# EAGLE schematic circuit (EAGLE 5.10)
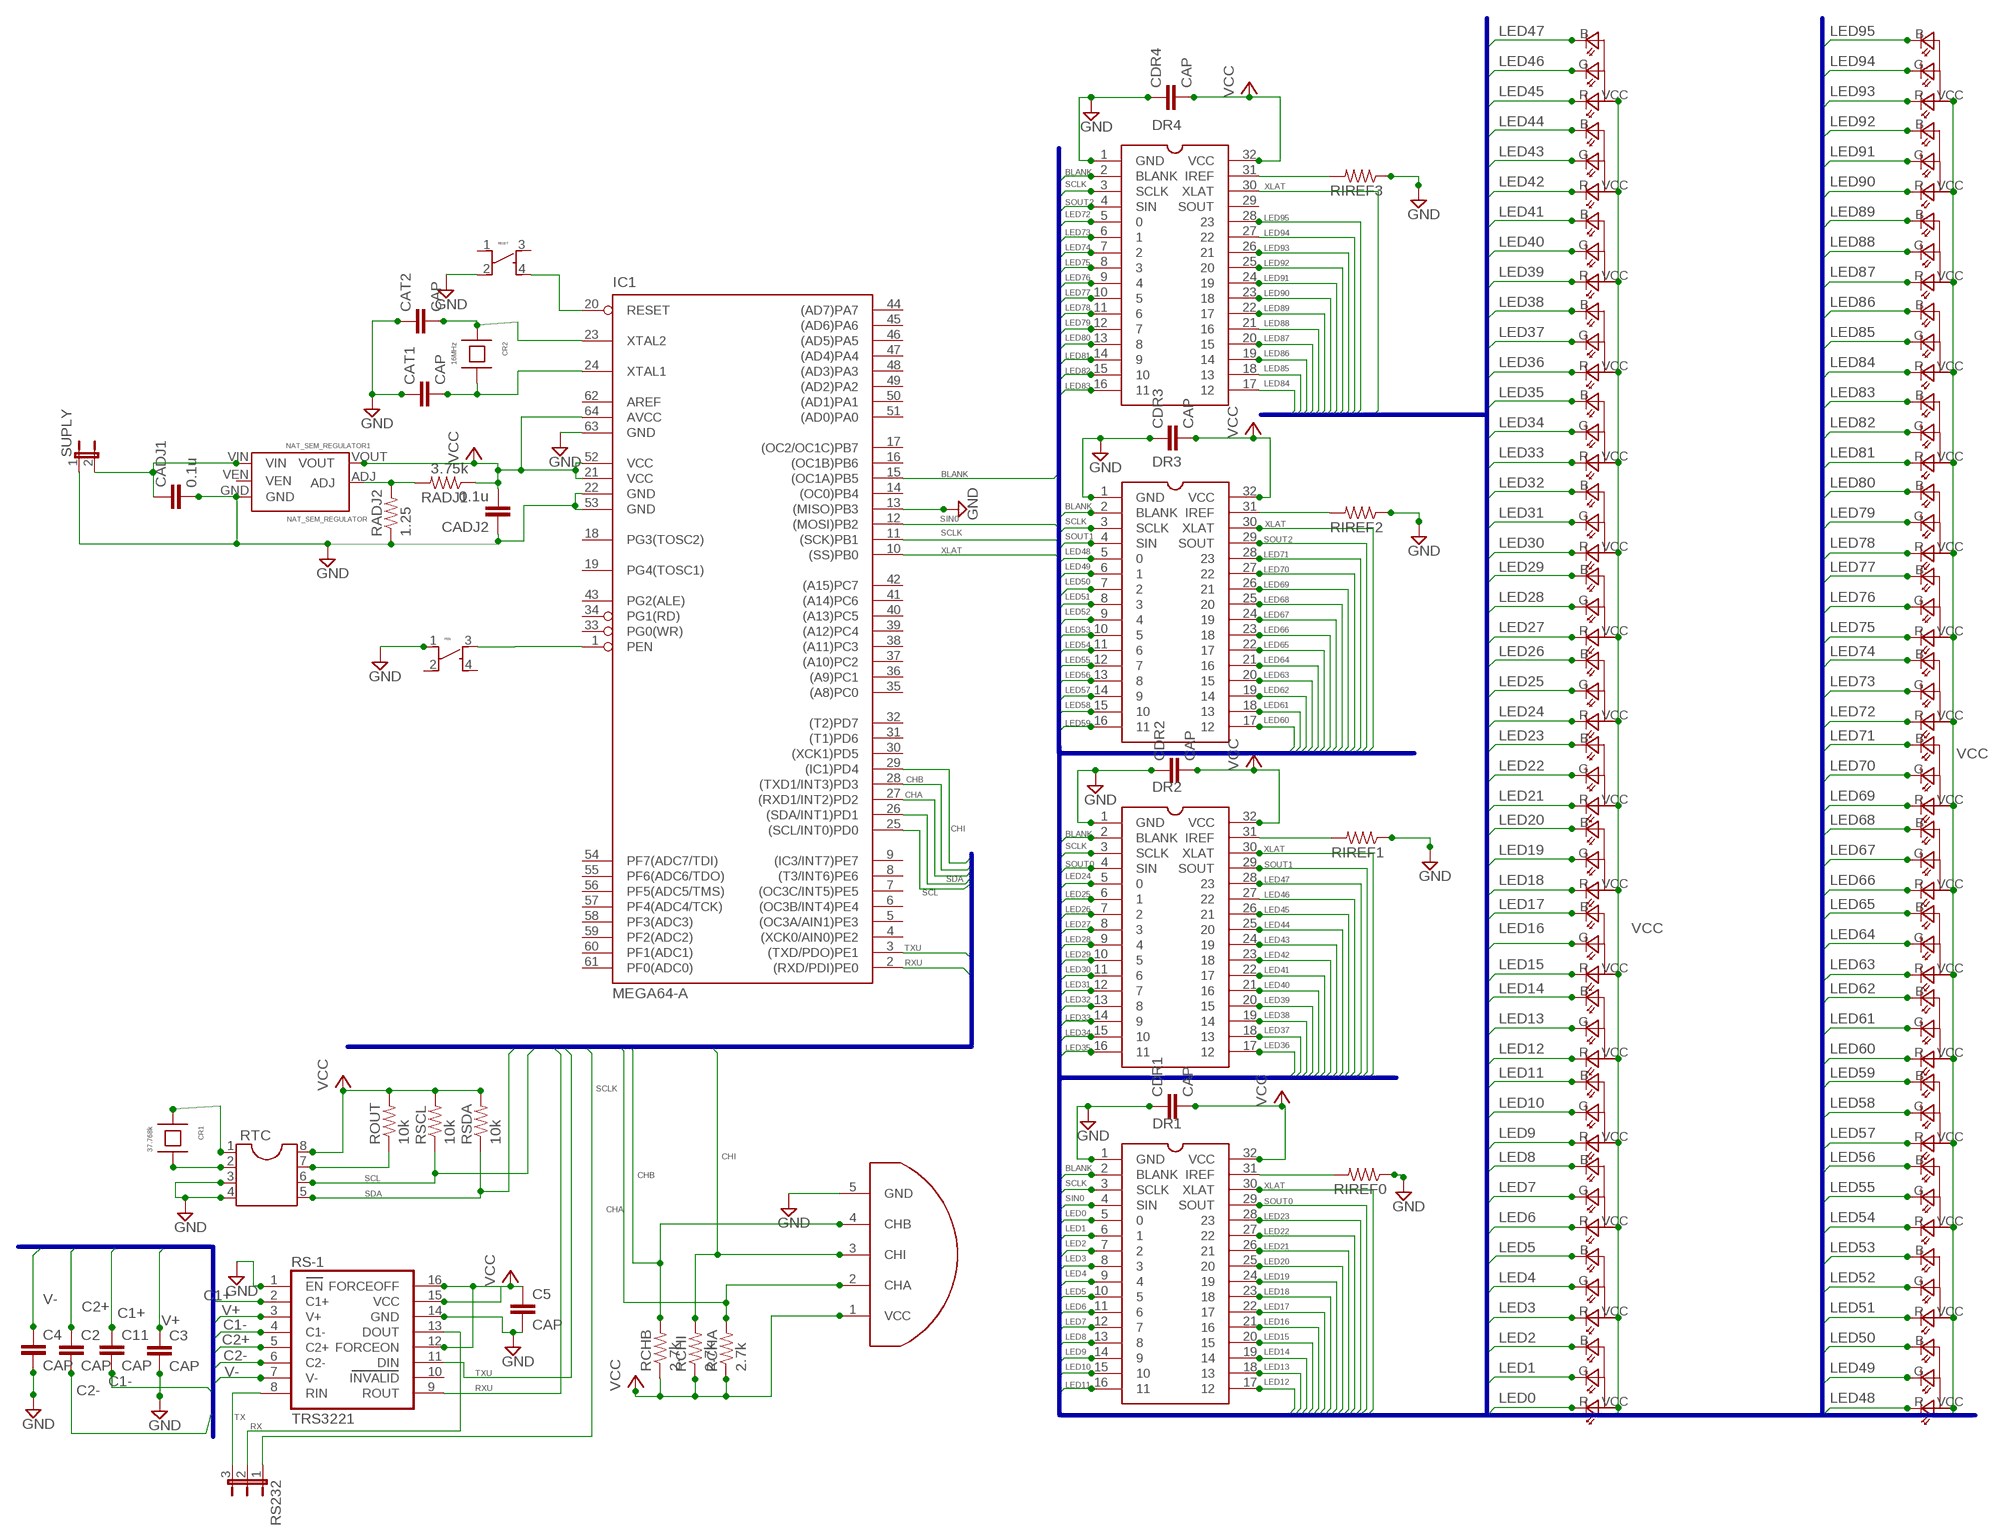
[diagram p0: schematic, sheet 1]

## Parts
C2  CAP  [CAP]
C3  CAP  [CAP]
C4  CAP  [CAP]
C5  CAP  [CAP]
C11  CAP  [CAP]
CADJ1  0.1u  CAP  [CAP]
CADJ2  0.1u  CAP  [CAP]
CAT1  CAP  [CAP]
CAT2  CAP  [CAP]
CDR1  CAP  [CAP]
CDR2  CAP  [CAP]
CDR3  CAP  [CAP]
CDR4  CAP  [CAP]
CR1  37.768k  CRYSTAL2  [CRYSTAL2]
CR2  16MHz  CRYSTAL2  [CRYSTAL2]
DR1  TLC5947  [TLC5947]
DR2  TLC5947  [TLC5947]
DR3  TLC5947  [TLC5947]
DR4  TLC5947  [TLC5947]
ENC  ENCODER-AEDB-9140  [ENCODER-AED8-9140]
IC1  MEGA64-A  [TQFP64]
NAT_SEM_REGULATOR1  NAT_SEM_REGULATOR  [NAT_SEM_REGULATOR]
PEN  PUSH_BUTTON  [PUSH_BUTTON]
RADJ1  3.75k  R-US_0204/5  [0204/5]
RADJ2  1.25  R-US_0204/5  [0204/5]
RCHA  2.7k  R-US_0204/5  [0204/5]
RCHB  2.7k  R-US_0204/5  [0204/5]
RCHI  2.7k  R-US_0204/5  [0204/5]
RESET  PUSH_BUTTON  [PUSH_BUTTON]
RGB1  ASMT-QTB0-0AA02-LED  [ASMT-QTB0-0AA02-LED]
RGB2  ASMT-QTB0-0AA02-LED  [ASMT-QTB0-0AA02-LED]
RGB3  ASMT-QTB0-0AA02-LED  [ASMT-QTB0-0AA02-LED]
RGB4  ASMT-QTB0-0AA02-LED  [ASMT-QTB0-0AA02-LED]
RGB5  ASMT-QTB0-0AA02-LED  [ASMT-QTB0-0AA02-LED]
RGB6  ASMT-QTB0-0AA02-LED  [ASMT-QTB0-0AA02-LED]
RGB7  ASMT-QTB0-0AA02-LED  [ASMT-QTB0-0AA02-LED]
RGB8  ASMT-QTB0-0AA02-LED  [ASMT-QTB0-0AA02-LED]
RGB9  ASMT-QTB0-0AA02-LED  [ASMT-QTB0-0AA02-LED]
RGB10  ASMT-QTB0-0AA02-LED  [ASMT-QTB0-0AA02-LED]
RGB11  ASMT-QTB0-0AA02-LED  [ASMT-QTB0-0AA02-LED]
RGB12  ASMT-QTB0-0AA02-LED  [ASMT-QTB0-0AA02-LED]
RGB13  ASMT-QTB0-0AA02-LED  [ASMT-QTB0-0AA02-LED]
RGB14  ASMT-QTB0-0AA02-LED  [ASMT-QTB0-0AA02-LED]
RGB15  ASMT-QTB0-0AA02-LED  [ASMT-QTB0-0AA02-LED]
RGB16  ASMT-QTB0-0AA02-LED  [ASMT-QTB0-0AA02-LED]
RGB17  ASMT-QTB0-0AA02-LED  [ASMT-QTB0-0AA02-LED]
RGB18  ASMT-QTB0-0AA02-LED  [ASMT-QTB0-0AA02-LED]
RGB19  ASMT-QTB0-0AA02-LED  [ASMT-QTB0-0AA02-LED]
RGB20  ASMT-QTB0-0AA02-LED  [ASMT-QTB0-0AA02-LED]
RGB21  ASMT-QTB0-0AA02-LED  [ASMT-QTB0-0AA02-LED]
RGB22  ASMT-QTB0-0AA02-LED  [ASMT-QTB0-0AA02-LED]
RGB23  ASMT-QTB0-0AA02-LED  [ASMT-QTB0-0AA02-LED]
RGB24  ASMT-QTB0-0AA02-LED  [ASMT-QTB0-0AA02-LED]
RGB25  ASMT-QTB0-0AA02-LED  [ASMT-QTB0-0AA02-LED]
RGB26  ASMT-QTB0-0AA02-LED  [ASMT-QTB0-0AA02-LED]
RGB27  ASMT-QTB0-0AA02-LED  [ASMT-QTB0-0AA02-LED]
RGB28  ASMT-QTB0-0AA02-LED  [ASMT-QTB0-0AA02-LED]
RGB29  ASMT-QTB0-0AA02-LED  [ASMT-QTB0-0AA02-LED]
RGB30  ASMT-QTB0-0AA02-LED  [ASMT-QTB0-0AA02-LED]
RGB31  ASMT-QTB0-0AA02-LED  [ASMT-QTB0-0AA02-LED]
RGB32  ASMT-QTB0-0AA02-LED  [ASMT-QTB0-0AA02-LED]
RIREF0  R-US_0204/5  [0204/5]
RIREF1  R-US_0204/5  [0204/5]
RIREF2  R-US_0204/5  [0204/5]
RIREF3  R-US_0204/5  [0204/5]
ROUT  10k  R-US_0204/5  [0204/5]
RS232  JP2W  [JP2W]
RS-1  TRS3221  [TRS3221]
RSCL  10k  R-US_0204/5  [0204/5]
RSDA  10k  R-US_0204/5  [0204/5]
RTC  DIL8  [DIL08]
SUPLY  JP1E  [JP1]

## Nets
BLANK: DR1.2(BLANK) DR2.2(BLANK) DR3.2(BLANK) DR4.2(BLANK) IC1.15((OC1A)PB5)
C1+: C11.1 RS-1.2(C1+)
C1-: C11.2 RS-1.4(C1-)
C2+: C2.1 RS-1.5(C2+)
C2-: C2.2 RS-1.6(C2-)
CHA: ENC.2(CHA) IC1.27((RXD1/INT2)PD2) RCHA.2
CHB: ENC.4(CHB) IC1.28((TXD1/INT3)PD3) RCHB.2
CHI: ENC.3(CHI) IC1.29((IC1)PD4) RCHI.2
GND: C3.2 C4.2 C5.2 CADJ1.2 CADJ2.1 CAT1.1 CAT2.1 CDR1.1 CDR2.1 CDR3.1 CDR4.1 DR1.1(GND) DR2.1(GND) DR3.1(GND) DR4.1(GND) ENC.5(GND) IC1.13((MISO)PB3) IC1.22(GND) IC1.53(GND) IC1.63(GND) NAT_SEM_REGULATOR1.GND PEN.1 RADJ2.1 RESET.2 RIREF0.1 RIREF1.1 RIREF2.1 RIREF3.1 RS-1.1(EN) RS-1.14(GND) RTC.3 RTC.4 SUPLY.1
IREF0: DR1.31(IREF) RIREF0.2
IREF1: DR2.31(IREF) RIREF1.2
IREF2: DR3.31(IREF) RIREF2.2
IREF3: DR4.31(IREF) RIREF3.2
LED0: DR1.5 RGB1.R
LED1: DR1.6 RGB1.G
LED2: DR1.7 RGB1.B
LED3: DR1.8 RGB2.R
LED4: DR1.9 RGB2.G
LED5: DR1.10 RGB2.B
LED6: DR1.11 RGB3.R
LED7: DR1.12 RGB3.G
LED8: DR1.13 RGB3.B
LED9: DR1.14 RGB4.R
LED10: DR1.15 RGB4.G
LED11: DR1.16 RGB4.B
LED12: DR1.17 RGB5.R
LED13: DR1.18 RGB5.G
LED14: DR1.19 RGB5.B
LED15: DR1.20 RGB6.R
LED16: DR1.21 RGB6.G
LED17: DR1.22 RGB6.B
LED18: DR1.23 RGB7.R
LED19: DR1.24 RGB7.G
LED20: DR1.25 RGB7.B
LED21: DR1.26 RGB8.R
LED22: DR1.27 RGB8.G
LED23: DR1.28 RGB8.B
LED24: DR2.5 RGB9.R
LED25: DR2.6 RGB9.G
LED26: DR2.7 RGB9.B
LED27: DR2.8 RGB10.R
LED28: DR2.9 RGB10.G
LED29: DR2.10 RGB10.B
LED30: DR2.11 RGB11.R
LED31: DR2.12 RGB11.G
LED32: DR2.13 RGB11.B
LED33: DR2.14 RGB12.R
LED34: DR2.15 RGB12.G
LED35: DR2.16 RGB12.B
LED36: DR2.17 RGB13.R
LED37: DR2.18 RGB13.G
LED38: DR2.19 RGB13.B
LED39: DR2.20 RGB14.R
LED40: DR2.21 RGB14.G
LED41: DR2.22 RGB14.B
LED42: DR2.23 RGB15.R
LED43: DR2.24 RGB15.G
LED44: DR2.25 RGB15.B
LED45: DR2.26 RGB16.R
LED46: DR2.27 RGB16.G
LED47: DR2.28 RGB16.B
LED48: DR3.5 RGB17.R
LED49: DR3.6 RGB17.G
LED50: DR3.7 RGB17.B
LED51: DR3.8 RGB18.R
LED52: DR3.9 RGB18.G
LED53: DR3.10 RGB18.B
LED54: DR3.11 RGB19.R
LED55: DR3.12 RGB19.G
LED56: DR3.13 RGB19.B
LED57: DR3.14 RGB20.R
LED58: DR3.15 RGB20.G
LED59: DR3.16 RGB20.B
LED60: DR3.17 RGB21.R
LED61: DR3.18 RGB21.G
LED62: DR3.19 RGB21.B
LED63: DR3.20 RGB22.R
LED64: DR3.21 RGB22.G
LED65: DR3.22 RGB22.B
LED66: DR3.23 RGB23.R
LED67: DR3.24 RGB23.G
LED68: DR3.25 RGB23.B
LED69: DR3.26 RGB24.R
LED70: DR3.27 RGB24.G
LED71: DR3.28 RGB24.B
LED72: DR4.5 RGB25.R
LED73: DR4.6 RGB25.G
LED74: DR4.7 RGB25.B
LED75: DR4.8 RGB26.R
LED76: DR4.9 RGB26.G
LED77: DR4.10 RGB26.B
LED78: DR4.11 RGB27.R
LED79: DR4.12 RGB27.G
LED80: DR4.13 RGB27.B
LED81: DR4.14 RGB28.R
LED82: DR4.15 RGB28.G
LED83: DR4.16 RGB28.B
LED84: DR4.17 RGB29.R
LED85: DR4.18 RGB29.G
LED86: DR4.19 RGB29.B
LED87: DR4.20 RGB30.R
LED88: DR4.21 RGB30.G
LED89: DR4.22 RGB30.B
LED90: DR4.23 RGB31.R
LED91: DR4.24 RGB31.G
LED92: DR4.25 RGB31.B
LED93: DR4.26 RGB32.R
LED94: DR4.27 RGB32.G
LED95: DR4.28 RGB32.B
N$1: IC1.20(RESET) RESET.4
N$5: NAT_SEM_REGULATOR1.ADJ RADJ1.2 RADJ2.2
N$22: CADJ1.1 NAT_SEM_REGULATOR1.VIN SUPLY.2
OUT: ROUT.1 RTC.7
PEN: IC1.1(PEN) PEN.3
RX: RS232.2 RS-1.13(DOUT)
RXU: IC1.2((RXD/PDI)PE0) RS-1.9(ROUT)
SCL: IC1.25((SCL/INT0)PD0) RSCL.1 RTC.6
SCLK: DR1.3(SCLK) DR2.3(SCLK) DR3.3(SCLK) DR4.3(SCLK) IC1.11((SCK)PB1) RS232.1
SDA: IC1.26((SDA/INT1)PD1) RSDA.1 RTC.5
SIN0: DR1.4(SIN) IC1.12((MOSI)PB2)
SOUT0: DR1.29(SOUT) DR2.4(SIN)
SOUT1: DR2.29(SOUT) DR3.4(SIN)
SOUT2: DR3.29(SOUT) DR4.4(SIN)
TX: RS232.3 RS-1.8(RIN)
TXU: IC1.3((TXD/PDO)PE1) RS-1.11(DIN)
V+: C3.1 RS-1.3(V+)
V-: C4.1 RS-1.7(V-)
VCC: C5.1 CADJ2.2 CDR1.2 CDR2.2 CDR3.2 CDR4.2 DR1.32(VCC) DR2.32(VCC) DR3.32(VCC) DR4.32(VCC) ENC.1(VCC) IC1.21(VCC) IC1.52(VCC) IC1.64(AVCC) NAT_SEM_REGULATOR1.VOUT RADJ1.1 RCHA.1 RCHB.1 RCHI.1 RGB1.VCC(GND) RGB2.VCC(GND) RGB3.VCC(GND) RGB4.VCC(GND) RGB5.VCC(GND) RGB6.VCC(GND) RGB7.VCC(GND) RGB8.VCC(GND) RGB9.VCC(GND) RGB10.VCC(GND) RGB11.VCC(GND) RGB12.VCC(GND) RGB13.VCC(GND) RGB14.VCC(GND) RGB15.VCC(GND) RGB16.VCC(GND) RGB17.VCC(GND) RGB18.VCC(GND) RGB19.VCC(GND) RGB20.VCC(GND) RGB21.VCC(GND) RGB22.VCC(GND) RGB23.VCC(GND) RGB24.VCC(GND) RGB25.VCC(GND) RGB26.VCC(GND) RGB27.VCC(GND) RGB28.VCC(GND) RGB29.VCC(GND) RGB30.VCC(GND) RGB31.VCC(GND) RGB32.VCC(GND) ROUT.2 RS-1.12(FORCEON) RS-1.15(VCC) RS-1.16(FORCEOFF) RSCL.2 RSDA.2 RTC.8
X1: CR1.1 RTC.1
X2: CR1.2 RTC.2
XLAT: DR1.30(XLAT) DR2.30(XLAT) DR3.30(XLAT) DR4.30(XLAT) IC1.10((SS)PB0)
XTAL1: CAT1.2 CR2.2 IC1.24(XTAL1)
XTAL2: CAT2.2 CR2.1 IC1.23(XTAL2)
Unconnected: DR4.29(SOUT) IC1.4((XCK0/AIN0)PE2) IC1.5((OC3A/AIN1)PE3) IC1.6((OC3B/INT4)PE4) IC1.7((OC3C/INT5)PE5) IC1.8((T3/INT6)PE6) IC1.9((IC3/INT7)PE7) IC1.14((OC0)PB4) IC1.16((OC1B)PB6) IC1.17((OC2/OC1C)PB7) IC1.18(PG3(TOSC2)) IC1.19(PG4(TOSC1)) IC1.30((XCK1)PD5) IC1.31((T1)PD6) IC1.32((T2)PD7) IC1.33(PG0(WR)) IC1.34(PG1(RD)) IC1.35((A8)PC0) IC1.36((A9)PC1) IC1.37((A10)PC2) IC1.38((A11)PC3) IC1.39((A12)PC4) IC1.40((A13)PC5) IC1.41((A14)PC6) IC1.42((A15)PC7) IC1.43(PG2(ALE)) IC1.44((AD7)PA7) IC1.45((AD6)PA6) IC1.46((AD5)PA5) IC1.47((AD4)PA4) IC1.48((AD3)PA3) IC1.49((AD2)PA2) IC1.50((AD1)PA1) IC1.51((AD0)PA0) IC1.54(PF7(ADC7/TDI)) IC1.55(PF6(ADC6/TDO)) IC1.56(PF5(ADC5/TMS)) IC1.57(PF4(ADC4/TCK)) IC1.58(PF3(ADC3)) IC1.59(PF2(ADC2)) IC1.60(PF1(ADC1)) IC1.61(PF0(ADC0)) IC1.62(AREF) NAT_SEM_REGULATOR1.VEN PEN.2 PEN.4 RESET.1 RESET.3 RS-1.10(INVALID)

## Buses
LED[0..95],BLANK,XLAT,SIN0,SOUT[0..2]
B$1
V+,C1+,C2+,C2-,C1-,V-,RIN,EN,TX,RX
B$3
SDA,SCL,RXU,TXU,CHA,CHB,CHI

## Library data of the parts
C2-C5 C11 CADJ1 CADJ2 CAT1 CAT2 CDR1-CDR4 = my_lib:CAP
CR1 CR2 = my_lib:CRYSTAL2
DR1-DR4 = my_lib:TLC5947: TLC5947 <http://focus.ti.com/docs/prod/folders/print/tlc5947.html> led driver with 24 output channel and 32 pins. SMD Package. Designed by: Patricio Lima.
ENC = my_lib:ENCODER-AEDB-9140
IC1 = atmel:MEGA64: MICROCONTROLLER 64 Kbytes FLASH 4 Kbytes SRAM 2 Kbytes EEPROM DUAL USART 8-channel 10 bit ADC Source: avr.lbr
NAT_SEM_REGULATOR1 = my_lib:NAT_SEM_REGULATOR
PEN RESET = my_lib:PUSH_BUTTON: Push button with four pins pin 1 connected to 3 and 2 connected to 4 Made by: Patricio Lima Jose borges Helder Lobato
RADJ1 RADJ2 RCHA RCHB RCHI RIREF0 RIREF1-RIREF3 ROUT RSCL RSDA = rcl:R-US_: RESISTOR, American symbol
RGB1-RGB32 = my_lib:ASMT-QTB0-0AA02-LED
RS232 = jumper:JP2W: JUMPER
RS-1 = my_lib:TRS3221
RTC = ic-package:DIL8: Dual In Line / Socket
SUPLY = jumper:JP1E: JUMPER